# Altium project PCB.PrjPcb
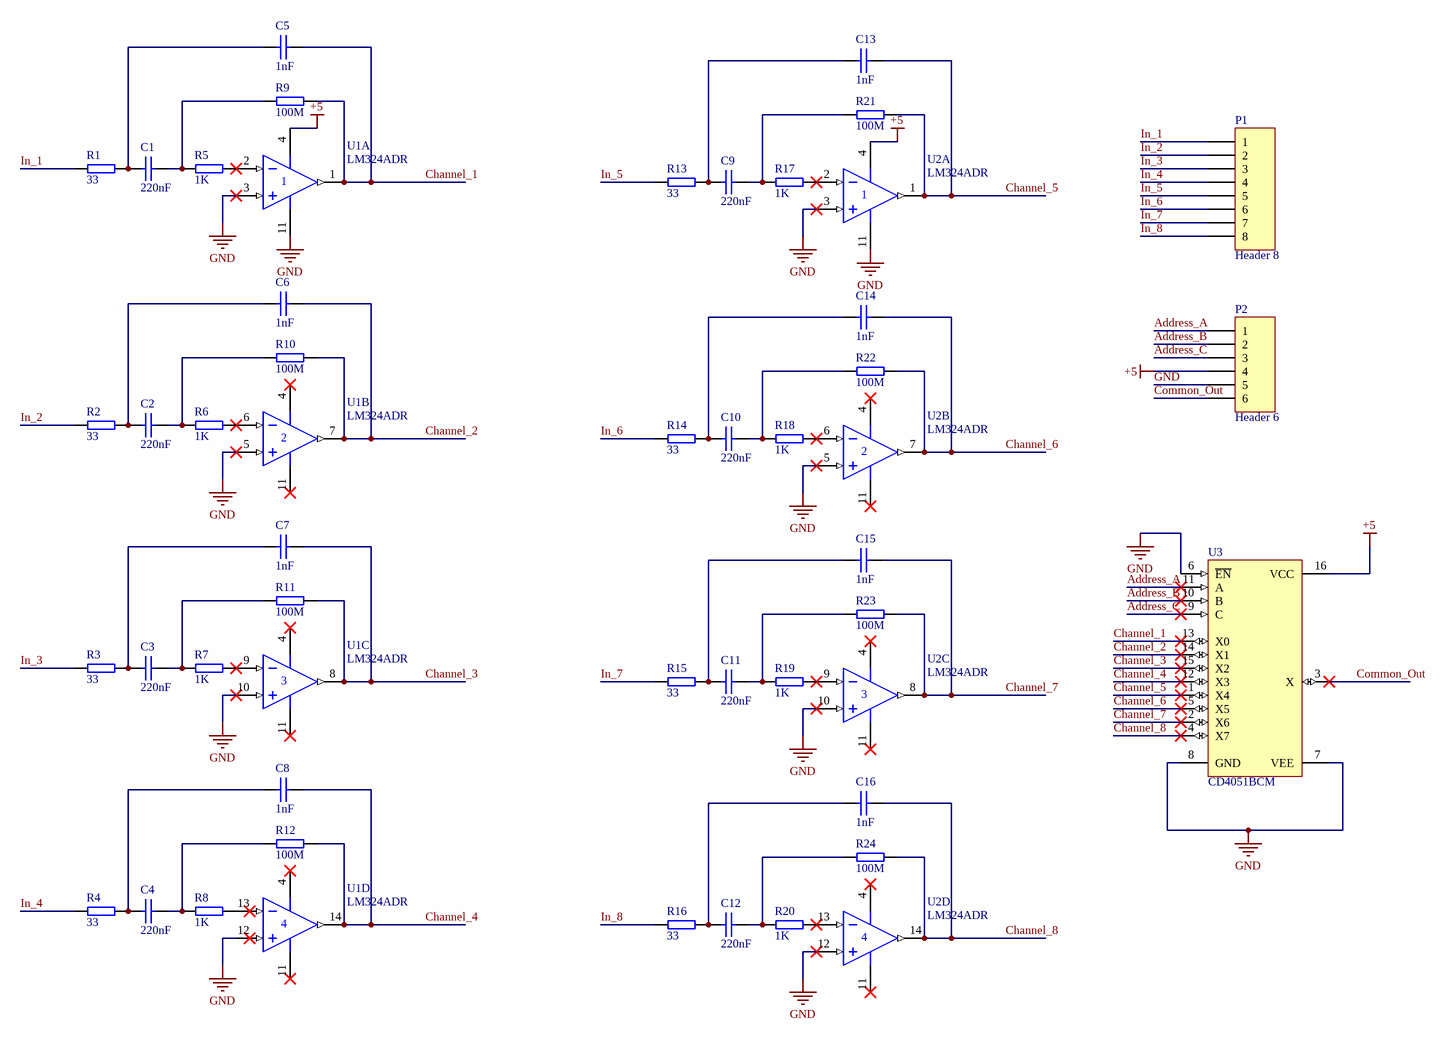
[diagram p0: PCByuanlitu.SchDoc]
1 sheet, 45 parts. Net scope: global (net labels, ports and power ports of the same name join across sheets).
Board file: PCB1.PcbDoc

## Sheet PCByuanlitu.SchDoc
size A3

### Parts
C1  220nF  [6-0805_L]
C2  220nF  [6-0805_L]
C3  220nF  [6-0805_L]
C4  220nF  [6-0805_L]
C5  1nF  [6-0805_L]
C6  1nF  [6-0805_L]
C7  1nF  [6-0805_L]
C8  1nF  [6-0805_L]
C9  220nF  [6-0805_L]
C10  220nF  [6-0805_L]
C11  220nF  [6-0805_L]
C12  220nF  [6-0805_L]
C13  1nF  [6-0805_L]
C14  1nF  [6-0805_L]
C15  1nF  [6-0805_L]
C16  1nF  [6-0805_L]
P1  Header 8  [HDR1X8]
P2  Header 6  [HDR1X6]
R1  33  [6-0805_M]
R2  33  [6-0805_M]
R3  33  [6-0805_M]
R4  33  [6-0805_M]
R5  1K  [6-0805_M]
R6  1K  [6-0805_M]
R7  1K  [6-0805_M]
R8  1K  [6-0805_M]
R9  100M  [6-0805_M]
R10  100M  [6-0805_M]
R11  100M  [6-0805_M]
R12  100M  [6-0805_M]
R13  33  [6-0805_M]
R14  33  [6-0805_M]
R15  33  [6-0805_M]
R16  33  [6-0805_M]
R17  1K  [6-0805_M]
R18  1K  [6-0805_M]
R19  1K  [6-0805_M]
R20  1K  [6-0805_M]
R21  100M  [6-0805_M]
R22  100M  [6-0805_M]
R23  100M  [6-0805_M]
R24  100M  [6-0805_M]
U1  LM324ADR  [D014_N]  (parts A,B,C,D of 4)
U2  LM324ADR  [D014_N]  (parts A,B,C,D of 4)
U3  CD4051BCM  [M16A_N]

### Nets
+5: P2.4 U1.4(V+) U2.4(V+) U3.16(VCC)
GND: P2.5 U1.3(IN+) U1.5(IN+) U1.10(IN+) U1.11(V-) U1.12(IN+) U2.3(IN+) U2.5(IN+) U2.10(IN+) U2.11(V-) U2.12(IN+) U3.6(~{EN}) U3.7(VEE) U3.8(GND)
Address_A: P2.1 U3.11(A)
Address_B: P2.2 U3.10(B)
Address_C: P2.3 U3.9(C)
Channel_1: C5.2 R9.2 U1.1(OUT) U3.13(X0)
Channel_2: C6.2 R10.2 U1.7(OUT) U3.14(X1)
Channel_3: C7.2 R11.2 U1.8(OUT) U3.15(X2)
Channel_4: C8.2 R12.2 U1.14(OUT) U3.12(X3)
Channel_5: C13.2 R21.2 U2.1(OUT) U3.1(X4)
Channel_6: C14.2 R22.2 U2.7(OUT) U3.5(X5)
Channel_7: C15.2 R23.2 U2.8(OUT) U3.2(X6)
Channel_8: C16.2 R24.2 U2.14(OUT) U3.4(X7)
Common_Out: P2.6 U3.3(X)
In_1: P1.1 R1.1
In_2: P1.2 R2.1
In_3: P1.3 R3.1
In_4: P1.4 R4.1
In_5: P1.5 R13.1
In_6: P1.6 R14.1
In_7: P1.7 R15.1
In_8: P1.8 R16.1
NetC1_1: C1.1 C5.1 R1.2
NetC1_2: C1.2 R5.1 R9.1
NetC2_1: C2.1 C6.1 R2.2
NetC2_2: C2.2 R6.1 R10.1
NetC3_1: C3.1 C7.1 R3.2
NetC3_2: C3.2 R7.1 R11.1
NetC4_1: C4.1 C8.1 R4.2
NetC4_2: C4.2 R8.1 R12.1
NetC9_1: C9.1 C13.1 R13.2
NetC9_2: C9.2 R17.1 R21.1
NetC10_1: C10.1 C14.1 R14.2
NetC10_2: C10.2 R18.1 R22.1
NetC11_1: C11.1 C15.1 R15.2
NetC11_2: C11.2 R19.1 R23.1
NetC12_1: C12.1 C16.1 R16.2
NetC12_2: C12.2 R20.1 R24.1
NetR5_2: R5.2 U1.2(IN-)
NetR6_2: R6.2 U1.6(IN-)
NetR7_2: R7.2 U1.9(IN-)
NetR8_2: R8.2 U1.13(IN-)
NetR17_2: R17.2 U2.2(IN-)
NetR18_2: R18.2 U2.6(IN-)
NetR19_2: R19.2 U2.9(IN-)
NetR20_2: R20.2 U2.13(IN-)

### Library data of the parts
C1-C16 = CAP: 电容
P1 = Header 8: Header, 8-Pin; LatestRevisionDate: 17-Jul-2002; LatestRevisionNote: Re-released for DXP Platform.; Publisher: Altium Limited
P2 = Header 6: Header, 6-Pin; LatestRevisionDate: 17-Jul-2002; LatestRevisionNote: Re-released for DXP Platform.; Publisher: Altium Limited
R1-R24 = RES: 电阻
U1 U2 = LM324ADR: Quadruple Operational Amplifier; Published: 15-Apr-2002; LatestRevisionDate: 13-Apr-2006; LatestRevisionNote: IPC-7351 Footprint Added.; DatasheetVersion: Jan-1989; PackageVersion: Jan-1998; PackageReference: D014; Publisher: Altium Limited; PackageDescription: 14-Pin Small Outline Integrated Circuit 1.27 mm Pitch; Code_IPC: SOIC127P600-14; ComponentLink1Description: Manufacturer Link; ComponentLink1URL: http://www.ti.com/; ComponentLink2Description: Datasheet; ComponentLink2URL: http://www-s.ti.com/sc/ds/lm324.pdf
U3 = CD4051BCM: 8-Channel Analog Multiplexer/Demultiplexer; Published: 17-Jul-2002; LatestRevisionDate: 13-Apr-2006; LatestRevisionNote: IPC-7351 Footprint Added.; DatasheetVersion: Jan-1999; PackageVersion: 2000; PackageReference: M16A; Publisher: Altium Limited; PackageDescription: 16-Pin Small Outline Integrated Circuit 1.27 mm Pitch; Code_IPC: SOIC127P600-16; ComponentLink1Description: Manufacturer Link; ComponentLink1URL: http://www.fairchildsemi.com/; ComponentLink2Description: Datasheet; ComponentLink2URL: http://www.fairchildsemi.com/ds/CD%2FCD4052BC.pdf